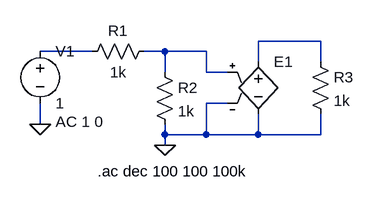
[diagram p0: schematic e_laplace.asc]
e_laplace.asc, the LTspice schematic file:
Version 4
SHEET 1 880 680
WIRE 480 96 384 96
WIRE 128 112 48 112
WIRE 240 112 208 112
WIRE 304 112 240 112
WIRE 384 128 384 96
WIRE 480 128 480 96
WIRE 240 144 240 112
WIRE 304 144 304 112
WIRE 336 144 304 144
WIRE 336 192 304 192
WIRE 48 224 48 192
WIRE 240 240 240 224
WIRE 304 240 304 192
WIRE 304 240 240 240
WIRE 384 240 384 208
WIRE 384 240 304 240
WIRE 480 240 480 208
WIRE 480 240 384 240
WIRE 240 256 240 240
FLAG 240 256 0
FLAG 48 224 0
SYMBOL res 112 128 R270
WINDOW 0 32 56 VTop 2
WINDOW 3 0 56 VBottom 2
SYMATTR InstName R1
SYMATTR Value 1k
SYMBOL voltage 48 96 R0
WINDOW 123 24 124 Left 2
WINDOW 39 0 0 Left 2
SYMATTR Value2 AC 1 0
SYMATTR InstName V1
SYMATTR Value 1
SYMBOL res 224 128 R0
SYMATTR InstName R2
SYMATTR Value 1k
SYMBOL e 384 112 R0
WINDOW 3 24 96 Invisible 2
SYMATTR Value 100/(1+s/62831.8)
SYMATTR InstName E1
SYMATTR SpiceModel laplace
SYMBOL res 464 112 R0
SYMATTR InstName R3
SYMATTR Value 1k
TEXT 136 296 Left 2 !.ac dec 100 100 100k

The netlist it stands for:
* e_laplace.asc
R1 N002 N003 1k
V1 N002 0 1 AC 1 0
R2 N003 0 1k
E1 N001 0 N003 0 laplace 100/(1+s/62831.8)
R3 N001 0 1k
.ac dec 100 100 100k
.backanno
.end